# Altium schematic sheet lauchpad_breakout.SchDoc
size A
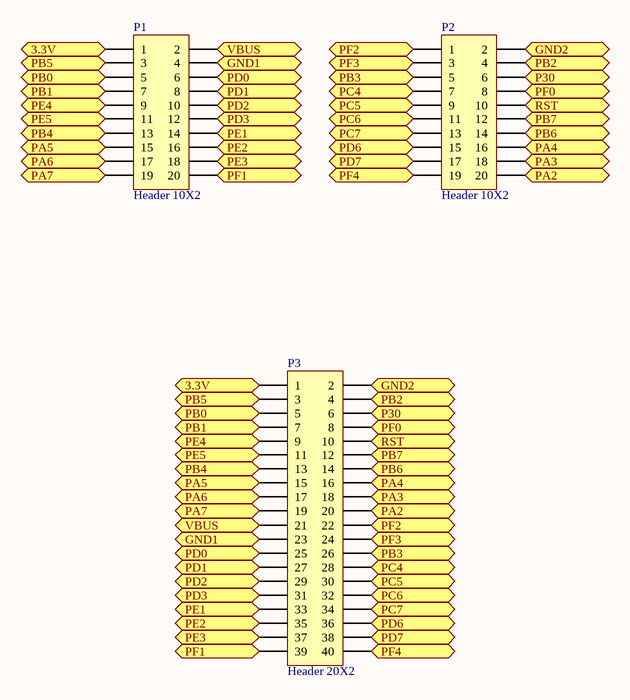
[diagram p0: lauchpad_breakout.SchDoc]

## Parts
P1  Header 10X2  [HDR2X10]
P2  Header 10X2  [HDR2X10]
P3  Header 20X2  [2x20wide]

## Ports
3.3V, GND1, GND2, P30, PA2, PA3, PA4, PA5, PA6, PA7, PB0, PB1, PB2, PB3, PB4, PB5, PB6, PB7, PC4, PC5, PC6, PC7, PD0, PD1, PD2, PD3, PD6, PD7, PE1, PE2, PE3, PE4, PE5, PF0, PF1, PF2, PF3, PF4, RST, VBUS

## Nets
3.3V: P1.1 P3.1 ; port 3.3V
GND1: P1.4 P3.23 ; port GND1
GND2: P2.2 P3.2 ; port GND2
P30: P2.6 P3.6 ; port P30
PA2: P2.20 P3.20 ; port PA2
PA3: P2.18 P3.18 ; port PA3
PA4: P2.16 P3.16 ; port PA4
PA5: P1.15 P3.15 ; port PA5
PA6: P1.17 P3.17 ; port PA6
PA7: P1.19 P3.19 ; port PA7
PB0: P1.5 P3.5 ; port PB0
PB1: P1.7 P3.7 ; port PB1
PB2: P2.4 P3.4 ; port PB2
PB3: P2.5 P3.26 ; port PB3
PB4: P1.13 P3.13 ; port PB4
PB5: P1.3 P3.3 ; port PB5
PB6: P2.14 P3.14 ; port PB6
PB7: P2.12 P3.12 ; port PB7
PC4: P2.7 P3.28 ; port PC4
PC5: P2.9 P3.30 ; port PC5
PC6: P2.11 P3.32 ; port PC6
PC7: P2.13 P3.34 ; port PC7
PD0: P1.6 P3.25 ; port PD0
PD1: P1.8 P3.27 ; port PD1
PD2: P1.10 P3.29 ; port PD2
PD3: P1.12 P3.31 ; port PD3
PD6: P2.15 P3.36 ; port PD6
PD7: P2.17 P3.38 ; port PD7
PE1: P1.14 P3.33 ; port PE1
PE2: P1.16 P3.35 ; port PE2
PE3: P1.18 P3.37 ; port PE3
PE4: P1.9 P3.9 ; port PE4
PE5: P1.11 P3.11 ; port PE5
PF0: P2.8 P3.8 ; port PF0
PF1: P1.20 P3.39 ; port PF1
PF2: P2.1 P3.22 ; port PF2
PF3: P2.3 P3.24 ; port PF3
PF4: P2.19 P3.40 ; port PF4
RST: P2.10 P3.10 ; port RST
VBUS: P1.2 P3.21 ; port VBUS

## Library data of the parts
P1 P2 = Header 10X2: Header, 10-Pin, Dual row; LatestRevisionDate: 17-Jul-2002; LatestRevisionNote: Re-released for DXP Platform.; Publisher: Altium Limited
P3 = Header 20X2: Header, 20-Pin, Dual row; LatestRevisionDate: 17-Jul-2002; LatestRevisionNote: Re-released for DXP Platform.; Publisher: Altium Limited